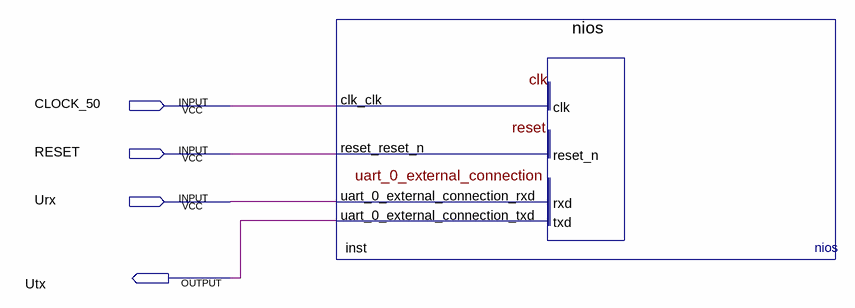
[diagram p0: schematic sheet]
// Quartus schematic setup_control.bdf as structural Verilog: 1 symbols, 4 pins
module setup_control (
  input  CLOCK_50,
  input  RESET,
  input  Urx,
  output Utx
);

  nios inst (
    .clk_clk(CLOCK_50), .reset_reset_n(RESET), .uart_0_external_connection_rxd(Urx),
    .uart_0_external_connection_txd(Utx));
endmodule
